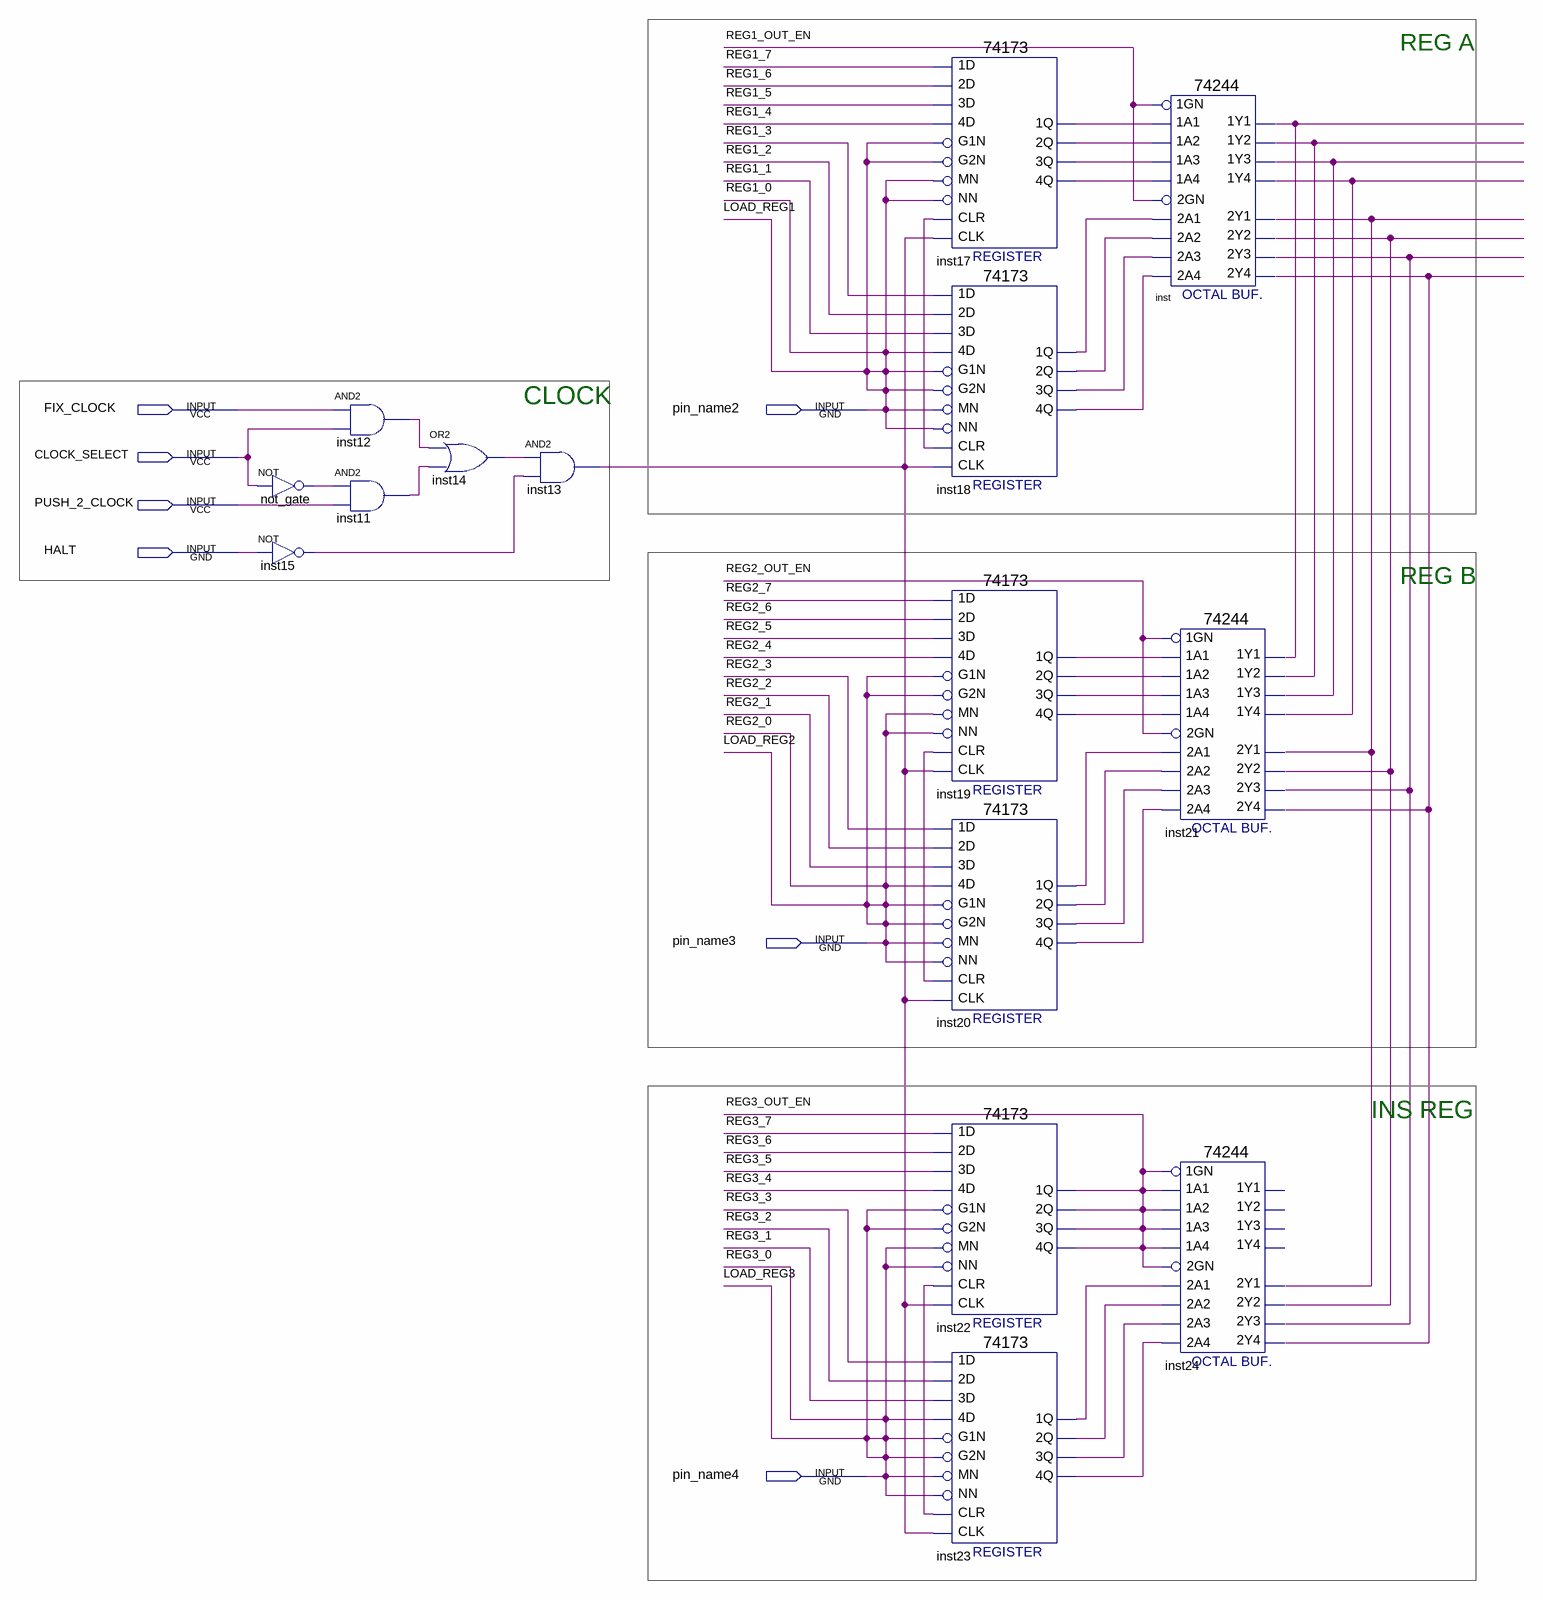
[diagram p0: schematic sheet]
// Quartus schematic AntoniusKusuma.bdf as structural Verilog: 15 symbols, 7 pins
module AntoniusKusuma (
  input  FIX_CLOCK,
  input  pin_name2,
  input  CLOCK_SELECT,
  input  PUSH_2_CLOCK,
  input  HALT,
  input  pin_name3,
  input  pin_name4
);

  wire inst11_out, inst12_out, inst13_out, inst14_out, inst15_out, inst17_1q, inst17_2q, inst17_3q,
       inst17_4q, inst18_1q, inst18_2q, inst18_3q, inst18_4q, inst19_1q, inst19_2q, inst19_3q, inst19_4q,
       inst20_1q, inst20_2q, inst20_3q, inst20_4q, inst23_1q, inst23_2q, inst23_3q, inst23_4q, inst_1y1,
       inst_1y2, inst_1y3, inst_1y4, inst_2y1, inst_2y2, inst_2y3, inst_2y4, not_gate_out, REG1_1, REG1_2,
       REG1_3, REG1_4, REG1_5, REG1_6, REG1_7, REG1_OUT_EN, REG2_1, REG2_2, REG2_3, REG2_4, REG2_5, REG2_6,
       REG2_7, REG2_OUT_EN, REG3_1, REG3_2, REG3_3, REG3_4, REG3_5, REG3_6, REG3_7, REG3_OUT_EN, undriven,
       undriven_2, undriven_3;

  not not_gate (not_gate_out, CLOCK_SELECT);
  not inst15 (inst15_out, HALT);
  and inst12 (inst12_out, FIX_CLOCK, CLOCK_SELECT);
  and inst11 (inst11_out, not_gate_out, PUSH_2_CLOCK);
  or inst14 (inst14_out, inst12_out, inst11_out);
  and inst13 (inst13_out, inst14_out, inst15_out);
  \74173  inst17 (
    .\3D (REG1_5), .MN(pin_name2), .\1D (REG1_7), .\2D (REG1_6), .\4D (REG1_4), .G1N(pin_name2),
    .G2N(pin_name2), .NN(pin_name2), .CLR(undriven), .CLK(inst13_out), .\3Q (inst17_3q), .\2Q (inst17_2q),
    .\1Q (inst17_1q), .\4Q (inst17_4q));
  \74173  inst18 (
    .\3D (REG1_1), .MN(pin_name2), .\1D (REG1_3), .\2D (REG1_2), .\4D (pin_name2), .G1N(pin_name2),
    .G2N(pin_name2), .NN(pin_name2), .CLR(undriven), .CLK(inst13_out), .\3Q (inst18_3q), .\2Q (inst18_2q),
    .\1Q (inst18_1q), .\4Q (inst18_4q));
  \74173  inst19 (
    .\3D (REG2_5), .MN(pin_name3), .\1D (REG2_7), .\2D (REG2_6), .\4D (REG2_4), .G1N(pin_name3),
    .G2N(pin_name3), .NN(pin_name3), .CLR(undriven_2), .CLK(inst13_out), .\3Q (inst19_3q), .\2Q (inst19_2q),
    .\1Q (inst19_1q), .\4Q (inst19_4q));
  \74173  inst20 (
    .\3D (REG2_1), .MN(pin_name3), .\1D (REG2_3), .\2D (REG2_2), .\4D (pin_name3), .G1N(pin_name3),
    .G2N(pin_name3), .NN(pin_name3), .CLR(undriven_2), .CLK(inst13_out), .\3Q (inst20_3q), .\2Q (inst20_2q),
    .\1Q (inst20_1q), .\4Q (inst20_4q));
  \74173  inst22 (
    .\3D (REG3_5), .MN(pin_name4), .\1D (REG3_7), .\2D (REG3_6), .\4D (REG3_4), .G1N(pin_name4),
    .G2N(pin_name4), .NN(pin_name4), .CLR(undriven_3), .CLK(inst13_out), .\3Q (REG3_OUT_EN),
    .\2Q (REG3_OUT_EN), .\1Q (REG3_OUT_EN), .\4Q (REG3_OUT_EN));
  \74173  inst23 (
    .\3D (REG3_1), .MN(pin_name4), .\1D (REG3_3), .\2D (REG3_2), .\4D (pin_name4), .G1N(pin_name4),
    .G2N(pin_name4), .NN(pin_name4), .CLR(undriven_3), .CLK(inst13_out), .\3Q (inst23_3q), .\2Q (inst23_2q),
    .\1Q (inst23_1q), .\4Q (inst23_4q));
  \74244  inst (
    .\1A2 (inst17_2q), .\1A4 (inst17_4q), .\1A1 (inst17_1q), .\1A3 (inst17_3q), .\1GN (REG1_OUT_EN),
    .\2A3 (inst18_3q), .\2GN (REG1_OUT_EN), .\2A1 (inst18_1q), .\2A4 (inst18_4q), .\2A2 (inst18_2q),
    .\1Y2 (inst_1y2), .\1Y4 (inst_1y4), .\2Y1 (inst_2y1), .\1Y1 (inst_1y1), .\2Y3 (inst_2y3),
    .\2Y4 (inst_2y4), .\1Y3 (inst_1y3), .\2Y2 (inst_2y2));
  \74244  inst21 (
    .\1A2 (inst19_2q), .\1A4 (inst19_4q), .\1A1 (inst19_1q), .\1A3 (inst19_3q), .\1GN (REG2_OUT_EN),
    .\2A3 (inst20_3q), .\2GN (REG2_OUT_EN), .\2A1 (inst20_1q), .\2A4 (inst20_4q), .\2A2 (inst20_2q),
    .\1Y2 (inst_1y2), .\1Y4 (inst_1y4), .\2Y1 (inst_2y1), .\1Y1 (inst_1y1), .\2Y3 (inst_2y3),
    .\2Y4 (inst_2y4), .\1Y3 (inst_1y3), .\2Y2 (inst_2y2));
  \74244  inst24 (
    .\1A2 (REG3_OUT_EN), .\1A4 (REG3_OUT_EN), .\1A1 (REG3_OUT_EN), .\1A3 (REG3_OUT_EN), .\1GN (REG3_OUT_EN),
    .\2A3 (inst23_3q), .\2GN (REG3_OUT_EN), .\2A1 (inst23_1q), .\2A4 (inst23_4q), .\2A2 (inst23_2q),
    .\2Y1 (inst_2y1), .\2Y3 (inst_2y3), .\2Y4 (inst_2y4), .\2Y2 (inst_2y2));  // open: 1Y2, 1Y4, 1Y1, 1Y3

  // Other names for the same wires on the sheet: LOAD_REG1 = pin_name2; REG1_0 = pin_name2; LOAD_REG2 = pin_name3;
  //   REG2_0 = pin_name3; LOAD_REG3 = pin_name4; REG3_0 = pin_name4

  // Notes on the sheet:
  //   REG A
  //   CLOCK
  //   REG B
  //   INS REG
endmodule
